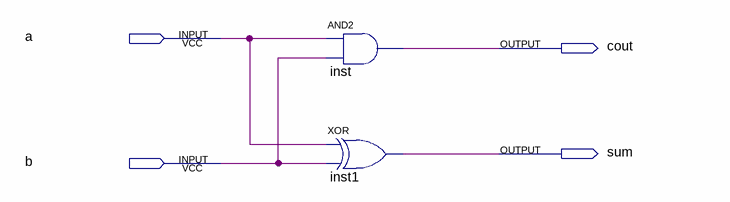
[diagram p0: schematic sheet]
// Quartus schematic add.bdf as structural Verilog: 2 symbols, 4 pins
module add (
  input  a,
  input  b,
  output cout,
  output sum
);

  and inst (cout, a, b);
  xor inst1 (sum, a, b);
endmodule
